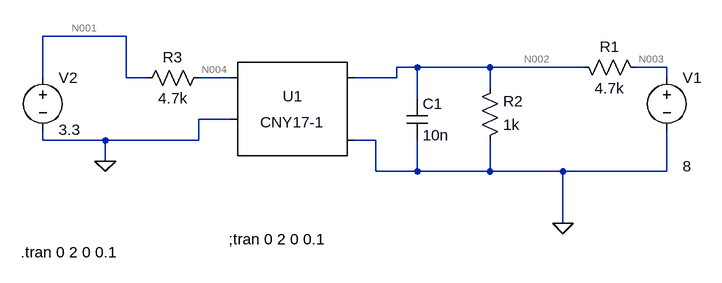
[diagram p0: schematic OPTTO-Input.asc]
OPTTO-Input.asc, the LTspice schematic file:
Version 4
SHEET 1 1052 680
WIRE -224 48 -352 48
WIRE 224 96 192 96
WIRE 336 96 224 96
WIRE 480 96 336 96
WIRE 608 96 560 96
WIRE -352 112 -352 48
WIRE -224 112 -224 48
WIRE -192 112 -224 112
WIRE -64 112 -112 112
WIRE 192 112 192 96
WIRE 192 112 128 112
WIRE 608 112 608 96
WIRE 336 128 336 96
WIRE 224 144 224 96
WIRE -64 176 -112 176
WIRE -352 208 -352 192
WIRE -256 208 -352 208
WIRE -112 208 -112 176
WIRE -112 208 -256 208
WIRE 160 208 128 208
WIRE -256 240 -256 208
WIRE 160 256 160 208
WIRE 224 256 224 208
WIRE 224 256 160 256
WIRE 336 256 336 208
WIRE 336 256 224 256
WIRE 448 256 336 256
WIRE 608 256 608 192
WIRE 608 256 448 256
WIRE 448 336 448 256
FLAG 448 336 0
FLAG -256 240 0
SYMBOL res 464 80 M90
WINDOW 0 0 56 VBottom 2
WINDOW 3 32 56 VTop 2
SYMATTR InstName R1
SYMATTR Value 4.7k
SYMBOL res 320 224 M180
WINDOW 0 36 76 Left 2
WINDOW 3 36 40 Left 2
SYMATTR InstName R2
SYMATTR Value 1k
SYMBOL cap 208 144 R0
SYMATTR InstName C1
SYMATTR Value 10n
SYMBOL voltage 608 96 R0
WINDOW 3 24 152 Left 2
WINDOW 123 24 124 Left 2
WINDOW 39 0 0 Left 2
SYMATTR InstName V1
SYMATTR Value 8
SYMBOL voltage -352 96 R0
WINDOW 123 0 0 Left 2
WINDOW 39 0 0 Left 2
SYMATTR InstName V2
SYMATTR Value 3.3
SYMBOL res -96 96 R90
WINDOW 0 0 56 VBottom 2
WINDOW 3 32 56 VTop 2
SYMATTR InstName R3
SYMATTR Value 4.7k
SYMBOL Optos\\CNY17-1 32 176 M0
SYMATTR InstName U1
TEXT -66 360 Left 2 !;tran 0 2 0 0.1
TEXT -386 380 Left 2 !.tran 0 2 0 0.1

The netlist it stands for:
* OPTTO-Input.asc
R1 N002 N003 4.7k
R2 0 N002 1k
C1 N002 0 10n
V1 N003 0 8
V2 N001 0 3.3
R3 N004 N001 4.7k
XU1 N002 0 N004 0 NC_01 CNY17 Igain=.724m
;tran 0 2 0 0.1
.tran 0 2 0 0.1
.lib CNY17.sub
.backanno
.end

* Results of the author's LTspice run, read from the files saved beside the schematic
* Operating Point, zero values left out:
*   V(n002) = 995.3 mV
*   V(n003) = 8 V
*   V(n001) = 3.3 V
*   V(n004) = 1.866 V
*   I(R3) = -305.2 µA
*   I(R2) = -995.3 µA
*   I(R1) = -1.49 mA
*   I(V2) = -305.2 µA
*   I(V1) = -1.49 mA
*   Ix(u1:1) = 495.1 µA
*   Ix(u1:2) = -495.1 µA
*   Ix(u1:3) = 305.2 µA
*   Ix(u1:4) = -305.2 µA